# EAGLE schematic alu_slice (EAGLE 7.1.0)
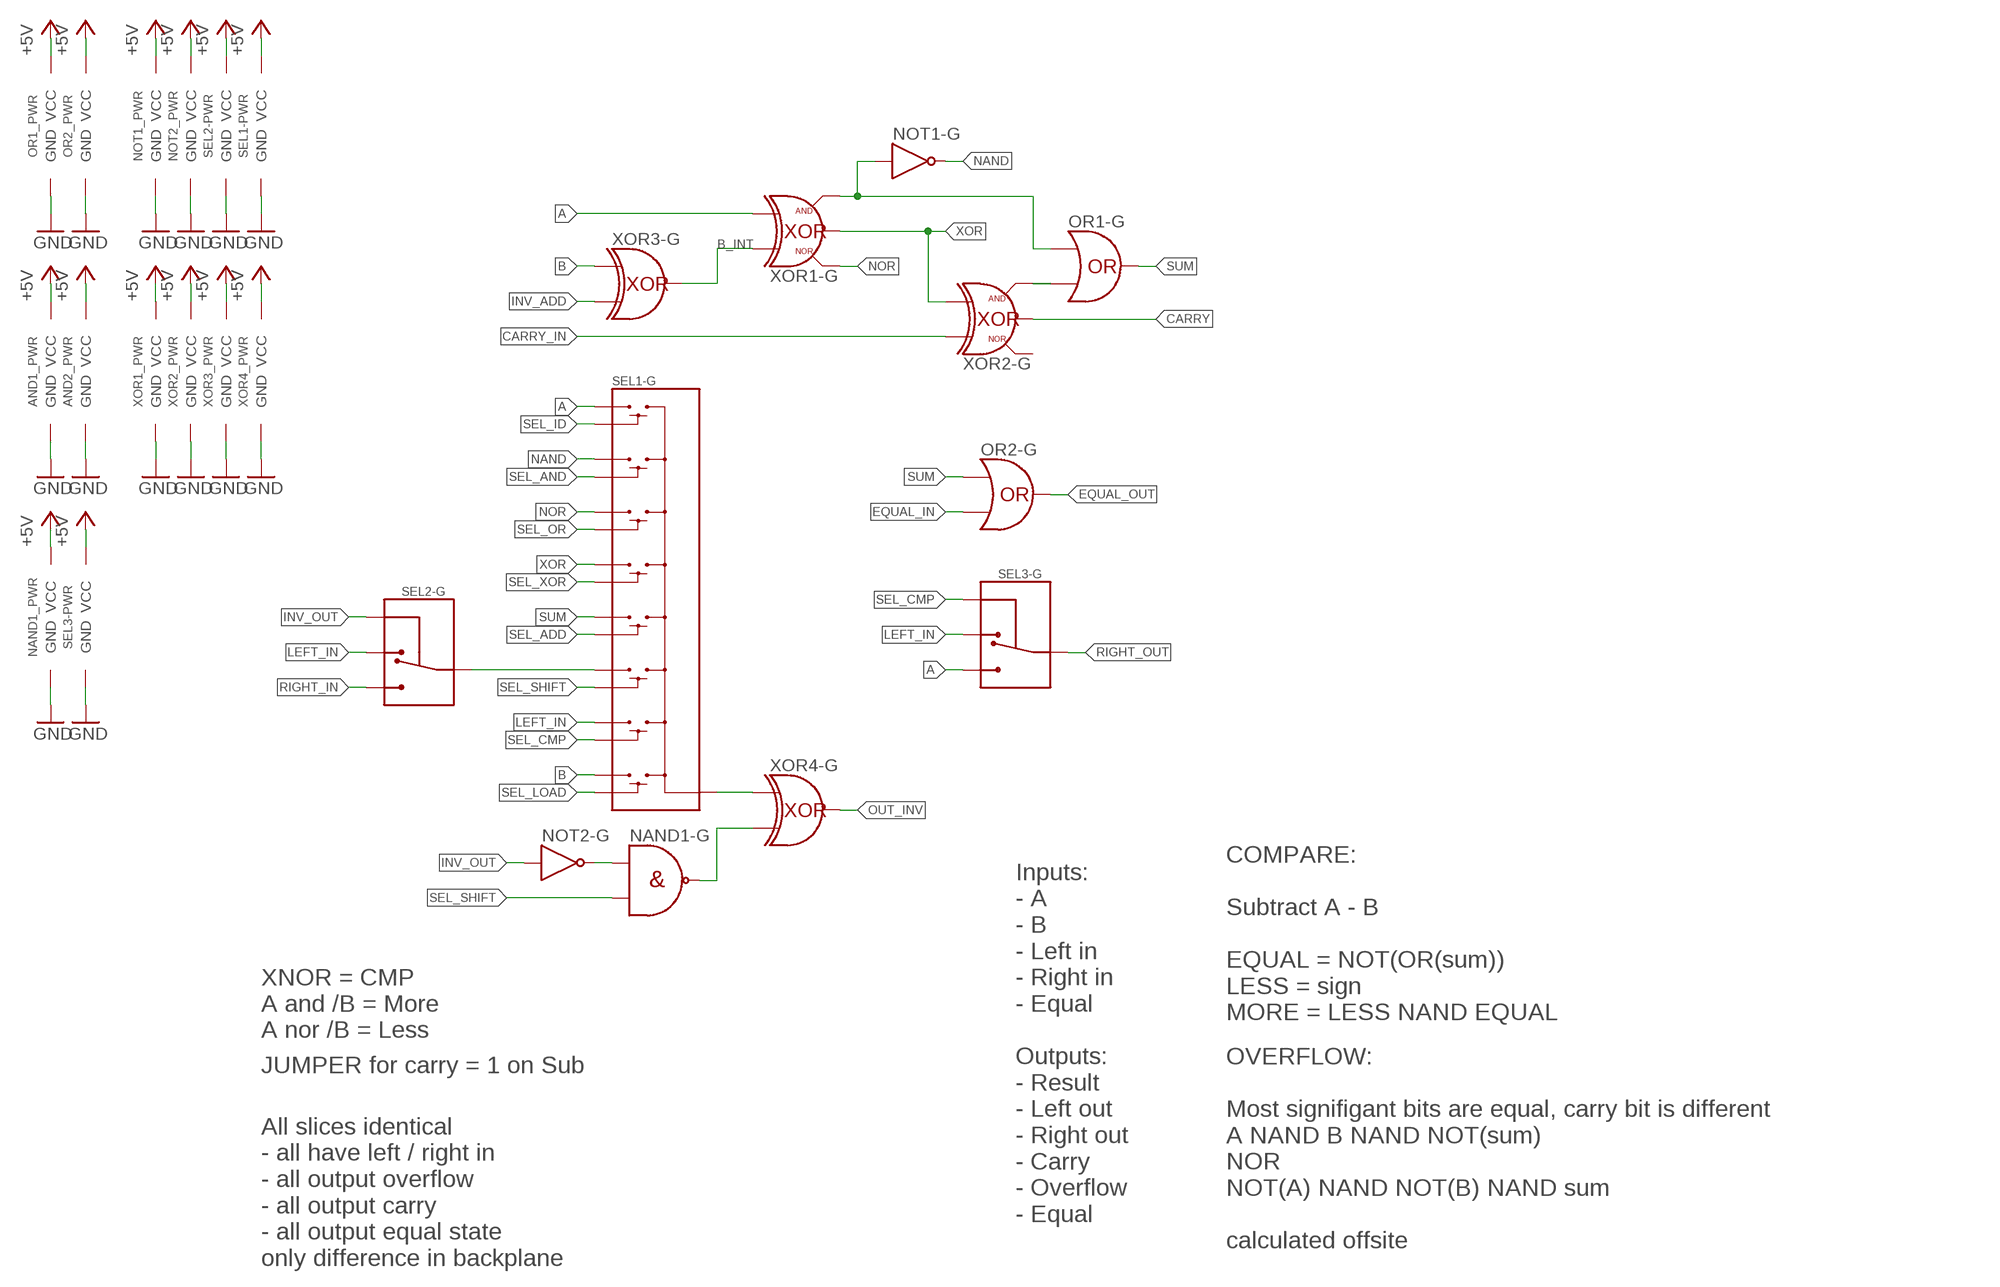
[diagram p0: schematic, sheet 1]

## Parts
AND1  AND-UNBUF  [AND-2-UNBUF]
AND2  AND-UNBUF  [AND-2-UNBUF]
NAND1  NAND  [NAND-2]
NOT1  NOT-VERTICAL  [NOT-VERTICAL]
NOT2  NOT-VERTICAL  [NOT-VERTICAL]
OR1  OR  [OR-2]
OR2  OR  [OR-2]
SEL1  SELECTOR  [SELECTOR-8_BIT-NOMUX]
SEL2  SELECTOR-2_LANES  [SELECTOR-2-LANE-NOMUX]
SEL3  SELECTOR-2_LANES  [SELECTOR-2-LANE-NOMUX]
XOR1  EX-XOR  [XOR-2-EX2]
XOR2  EX-XOR  [XOR-2-EX2]
XOR3  XOR  [XOR-2-EX2]
XOR4  XOR  [XOR-2-EX2]

## Nets
+5V: AND1.OUT3(_PWR:VCC) AND2.OUT3(_PWR:VCC) NAND1.OUT1(_PWR:VCC) NOT1.OUT3(_PWR:VCC) NOT2.OUT3(_PWR:VCC) OR1.OUT3(_PWR:VCC) OR2.OUT3(_PWR:VCC) SEL1.V+(-PWR:VCC) SEL2.V+(-PWR:VCC) SEL3.V+(-PWR:VCC) XOR1.OUT1(_PWR:VCC) XOR2.OUT1(_PWR:VCC) XOR3.OUT1(_PWR:VCC) XOR4.OUT1(_PWR:VCC)
A: SEL1.IN1(-G:IN1) SEL3.IN2(-G:IN2) XOR1.B(-G:B)
B: SEL1.IN8(-G:IN8) XOR3.A(-G:A)
B_INT: XOR1.A(-G:A) XOR3.OUT4(-G:OUT)
CARRY: XOR2.OUT4(-G:OUT)
CARRY_IN: XOR2.A(-G:A)
EQUAL_IN: OR2.B(-G:B)
EQUAL_OUT: OR2.OUT1(-G:OUT)
GND: AND1.OUT1(_PWR:GND) AND2.OUT1(_PWR:GND) NAND1.OUT3(_PWR:GND) NOT1.OUT2(_PWR:GND) NOT2.OUT2(_PWR:GND) OR1.OUT2(_PWR:GND) OR2.OUT2(_PWR:GND) SEL1.GND(-PWR:GND) SEL2.GND(-PWR:GND) SEL3.GND(-PWR:GND) XOR1.OUT5(_PWR:GND) XOR2.OUT5(_PWR:GND) XOR3.OUT5(_PWR:GND) XOR4.OUT5(_PWR:GND)
INV_ADD: XOR3.B(-G:B)
INV_OUT: NOT2.IN(-G:IN) SEL2.SEL(-G:SEL)
LEFT_IN: SEL1.IN7(-G:IN7) SEL2.IN1(-G:IN1) SEL3.IN1(-G:IN1)
N$1: NOT1.IN(-G:IN) OR1.A(-G:A) XOR1.OUT2(-G:AND)
N$2: OR1.B(-G:B) XOR2.OUT2(-G:AND)
N$3: SEL1.IN6(-G:IN6) SEL2.OUT(-G:OUT)
N$4: NAND1.OUT2(-G:OUT) XOR4.B(-G:B)
N$5: NAND1.B(-G:A) NOT2.OUT1(-G:OUT)
NAND: NOT1.OUT1(-G:OUT) SEL1.IN2(-G:IN2)
NOR: SEL1.IN3(-G:IN3) XOR1.OUT3(-G:NOR)
OUT: SEL1.OUT(-G:OUT) XOR4.A(-G:A)
OUT_INV: XOR4.OUT4(-G:OUT)
RIGHT_IN: SEL2.IN2(-G:IN2)
RIGHT_OUT: SEL3.OUT(-G:OUT)
SEL_ADD: SEL1.SEL5(-G:SEL5)
SEL_AND: SEL1.SEL2(-G:SEL2)
SEL_CMP: SEL1.SEL7(-G:SEL7) SEL3.SEL(-G:SEL)
SEL_ID: SEL1.SEL1(-G:SEL1)
SEL_LOAD: SEL1.SEL8(-G:SEL8)
SEL_OR: SEL1.SEL3(-G:SEL3)
SEL_SHIFT: NAND1.A(-G:B) SEL1.SEL6(-G:SEL6)
SEL_XOR: SEL1.SEL4(-G:SEL4)
SUM: OR1.OUT1(-G:OUT) OR2.A(-G:A) SEL1.IN5(-G:IN5)
XOR: SEL1.IN4(-G:IN4) XOR1.OUT4(-G:OUT) XOR2.B(-G:B)
Unconnected: AND1.A(-G:B) AND1.B(-G:A) AND1.OUT2(-G:OUT) AND2.A(-G:B) AND2.B(-G:A) AND2.OUT2(-G:OUT) XOR2.OUT3(-G:NOR)

## Notes on the sheet
- XNOR = CMP
- COMPARE:
  
  Subtract A - B
  
  EQUAL = NOT(OR(sum))
  LESS = sign
  MORE = LESS NAND EQUAL
- A and /B = More
  A nor /B = Less
- JUMPER for carry = 1 on Sub
- Inputs:
  - A
  - B
  - Left in
  - Right in
  - Equal
  
  Outputs:
  - Result
  - Left out
  - Right out
  - Carry
  - Overflow
  - Equal
- OVERFLOW:
  
  Most signifigant bits are equal, carry bit is different
  A NAND B NAND NOT(sum)
  NOR
  NOT(A) NAND NOT(B) NAND sum
  
  calculated offsite
- All slices identical
  - all have left / right in
  - all output overflow
  - all output carry
  - all output equal state
  only difference in backplane

## Library data of the parts
AND1 AND2 = p.peter-logic:AND
NAND1 = p.peter-logic:NAND
NOT1 NOT2 = p.peter-logic:NOT
OR1 OR2 = p.peter-logic:OR
SEL1 = p.peter-logic:SELECTOR
SEL2 SEL3 = p.peter-logic:SELECTOR-2_LANES
XOR1 XOR2 = p.peter-logic:EX-XOR
XOR3 XOR4 = p.peter-logic:XOR